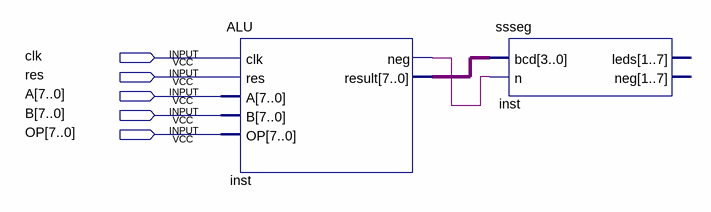
[diagram p0: schematic sheet]
// Quartus schematic justALU1.bdf as structural Verilog: 2 symbols, 5 pins
module justALU1 (
  input  clk,
  input  res,
  input  [7:0] A,
  input  [7:0] B,
  input  [7:0] OP
);

  wire inst_neg;
  wire [7:0] inst_result;

  ALU inst (.clk(clk), .res(res), .A(A), .B(B), .OP(OP), .neg(inst_neg), .result(inst_result));
  ssseg inst_dup2 (.bcd(inst_result), .n(inst_neg));  // open: leds, neg
endmodule
